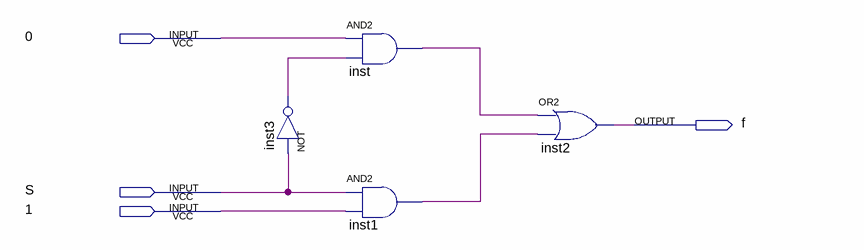
[diagram p0: schematic sheet]
// Quartus schematic 2to1Mux.bdf as structural Verilog: 4 symbols, 4 pins
module \2to1Mux  (
  input  \0 ,
  input  S,
  input  \1 ,
  output f
);

  wire inst1_out, inst3_out, inst_out;

  not inst3 (inst3_out, S);
  and inst (inst_out, \0 , inst3_out);
  and inst1 (inst1_out, S, \1 );
  or inst2 (f, inst_out, inst1_out);
endmodule
